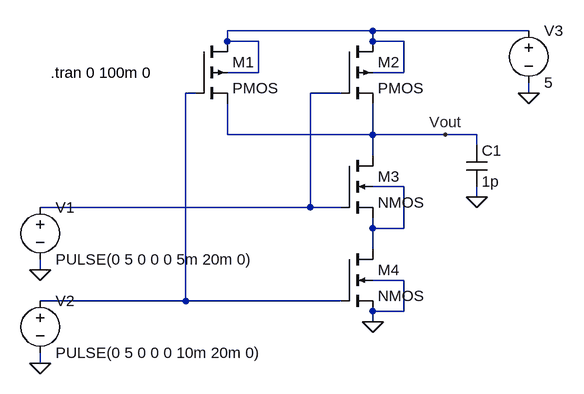
[diagram p0: schematic CMOS_Nand1.asc]
CMOS_Nand1.asc, the LTspice schematic file:
Version 4.1
SHEET 1 880 680
WIRE 400 64 176 64
WIRE 640 64 400 64
WIRE 176 80 176 64
WIRE 224 80 176 80
WIRE 400 80 400 64
WIRE 448 80 400 80
WIRE 224 128 224 80
WIRE 224 128 176 128
WIRE 448 128 448 80
WIRE 448 128 400 128
WIRE 128 160 112 160
WIRE 352 160 304 160
WIRE 640 160 640 144
WIRE 176 224 176 176
WIRE 400 224 400 176
WIRE 400 224 176 224
WIRE 512 224 400 224
WIRE 560 224 512 224
WIRE 560 240 560 224
WIRE 400 256 400 224
WIRE 448 304 400 304
WIRE 560 320 560 304
WIRE 304 336 304 160
WIRE 304 336 -112 336
WIRE 352 336 304 336
WIRE 400 368 400 352
WIRE 448 368 448 304
WIRE 448 368 400 368
WIRE 400 400 400 368
WIRE -112 432 -112 416
WIRE 448 448 400 448
WIRE 112 480 112 160
WIRE 112 480 -112 480
WIRE 352 480 112 480
WIRE 448 496 448 448
WIRE 448 496 400 496
WIRE 400 512 400 496
WIRE -112 576 -112 560
FLAG -112 432 0
FLAG -112 576 0
FLAG 400 512 0
FLAG 640 160 0
FLAG 560 320 0
FLAG 512 224 Vout
SYMBOL pmos4 128 80 R0
SYMATTR InstName M1
SYMBOL pmos4 352 80 R0
SYMATTR InstName M2
SYMBOL nmos4 352 256 R0
SYMATTR InstName M3
SYMBOL nmos4 352 400 R0
SYMATTR InstName M4
SYMBOL voltage -112 320 R0
WINDOW 123 0 0 Left 0
WINDOW 39 0 0 Left 0
SYMATTR InstName V1
SYMATTR Value PULSE(0 5 0 0 0 5m 20m 0)
SYMBOL voltage -112 464 R0
WINDOW 123 0 0 Left 0
WINDOW 39 0 0 Left 0
SYMATTR InstName V2
SYMATTR Value PULSE(0 5 0 0 0 10m 20m 0)
SYMBOL voltage 640 48 R0
WINDOW 123 0 0 Left 0
WINDOW 39 0 0 Left 0
SYMATTR InstName V3
SYMATTR Value 5
SYMBOL cap 544 240 R0
SYMATTR InstName C1
SYMATTR Value 1p
TEXT -96 128 Left 2 !.tran 0 100m 0

The netlist it stands for:
* CMOS_Nand1.asc
M1 N001 N002 Vout N001 PMOS
M2 N001 N003 Vout N001 PMOS
M3 Vout N003 N004 N004 NMOS
M4 N004 N002 0 0 NMOS
V1 N003 0 PULSE(0 5 0 0 0 5m 20m 0)
V2 N002 0 PULSE(0 5 0 0 0 10m 20m 0)
V3 N001 0 5
C1 Vout 0 1p
.model NMOS NMOS
.model PMOS PMOS
.lib standard.mos
.tran 0 100m 0
.backanno
.end